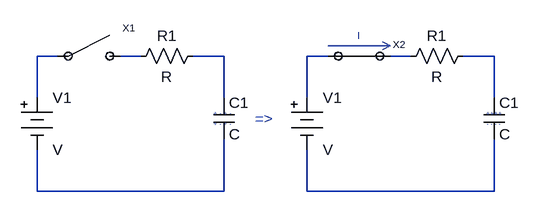
[diagram p0: schematic Charging Cap.asc]
Charging Cap.asc, the LTspice schematic file:
Version 4
SHEET 1 880 680
WIRE 112 96 80 96
WIRE 240 96 208 96
WIRE 368 96 320 96
WIRE 528 96 496 96
WIRE 656 96 624 96
WIRE 784 96 736 96
WIRE 80 160 80 96
WIRE 368 160 368 96
WIRE 496 160 496 96
WIRE 784 160 784 96
WIRE 80 304 80 240
WIRE 368 304 368 224
WIRE 368 304 80 304
WIRE 496 304 496 240
WIRE 784 304 784 224
WIRE 784 304 496 304
SYMBOL Misc\\battery 80 144 R0
SYMATTR InstName V1
SYMBOL res 336 80 R90
WINDOW 0 0 56 VBottom 2
WINDOW 3 32 56 VTop 2
SYMATTR InstName R1
SYMBOL cap 352 160 R0
SYMATTR InstName C1
SYMBOL SPST 160 80 R0
SYMATTR InstName X1
SYMBOL Misc\\battery 496 144 R0
SYMATTR InstName V1
SYMBOL res 752 80 R90
WINDOW 0 0 56 VBottom 2
WINDOW 3 32 56 VTop 2
SYMATTR InstName R1
SYMBOL cap 768 160 R0
SYMATTR InstName C1
SYMBOL SPST\ -\ Closed 576 80 R0
SYMATTR InstName X2
TEXT 352 184 Left 0 ;+ - + -
TEXT 352 200 Left 0 ;+ - + -
TEXT 784 184 Center 0 ;++++
TEXT 784 200 Center 0 ;- - - -
TEXT 576 64 Center 1 ;I
TEXT 416 192 Left 2 ;=>
LINE Normal 624 80 528 80
LINE Normal 612 74 624 80
LINE Normal 624 80 612 74
LINE Normal 612 86 624 80

The netlist it stands for:
* Charging Cap.asc
V1 N001 N007 V
R1 N003 N002 R
C1 N003 N007 C
XX1 N001 N002 SPST
V1 N004 N008 V
R1 N006 N005 R
C1 N006 N008 C
XX2 N004 N005 SPST - Closed
* + - + -
* + - + -
* ++++
* - - - -
* I
* =>
.backanno
.end